# Altium schematic sheet Sensors.SchDoc
size A; SheetNumber: 3; SheetTotal: 8
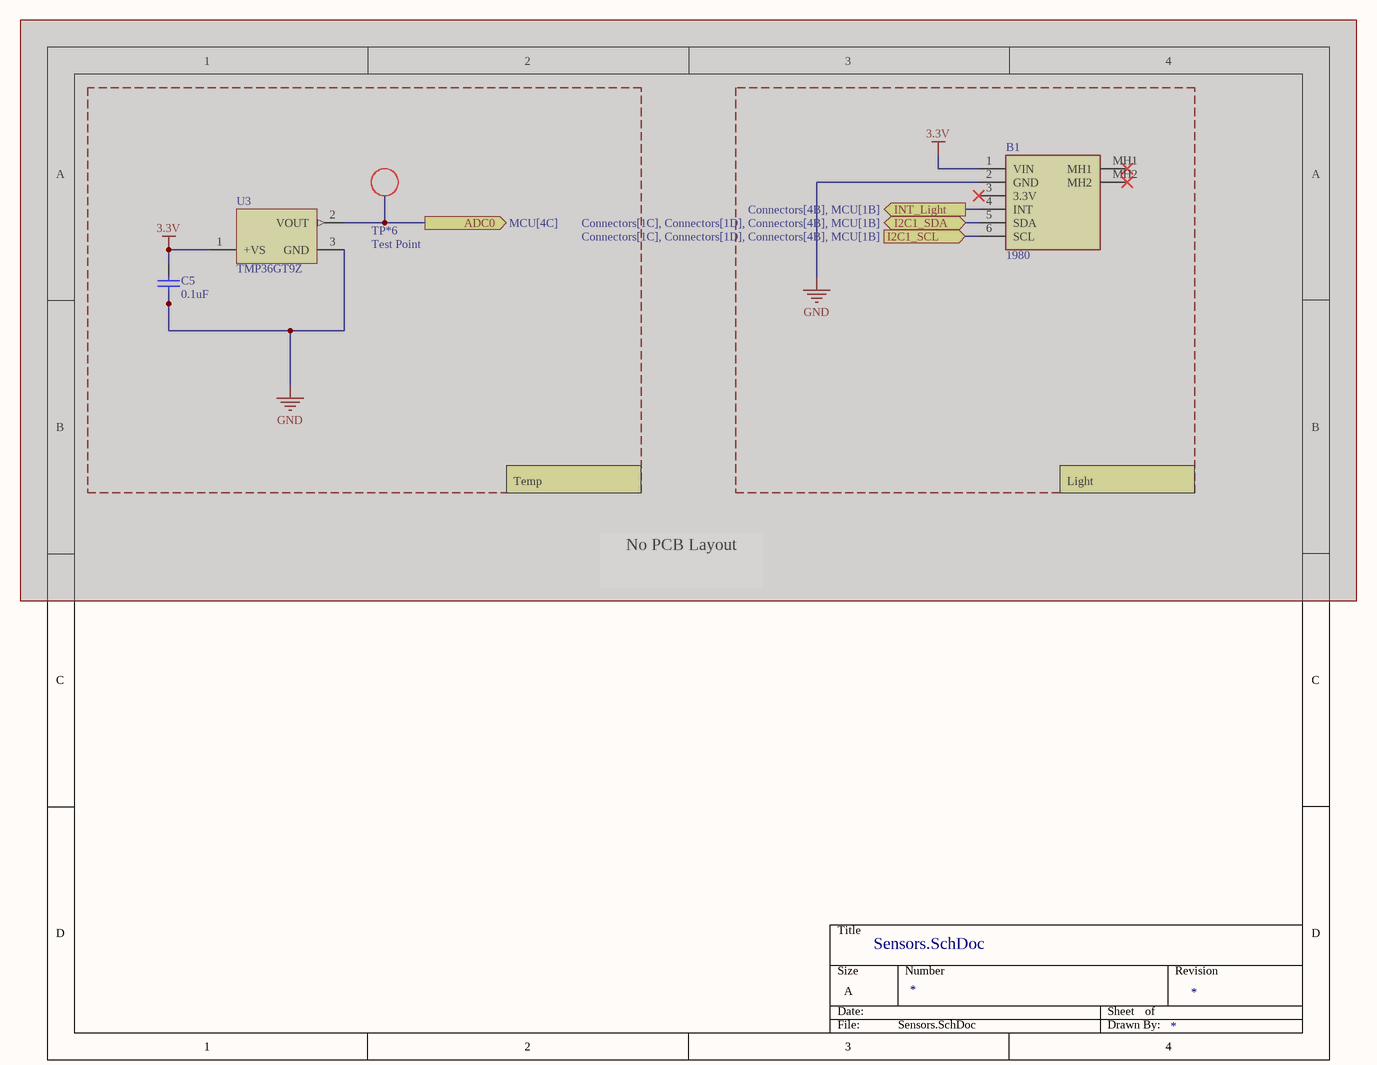
[diagram p0: Sensors.SchDoc]

## Parts
B1  1980  [1980]  (mechanical)  (masked out: inside a compile mask, not in the netlist)
C5  value 0.1uF  (hidden comment: Capacitor)  (masked out: inside a compile mask, not in the netlist)
TP*6  Test Point  [Test Point-Footprint-1]  (mechanical)  (masked out: inside a compile mask, not in the netlist)
U3  TMP36GT9Z  [ADI-T-3]  (mechanical)  (masked out: inside a compile mask, not in the netlist)

## Ports
ADC0 (out, see MCU[4C]), I2C1_SCL (in, see Connectors[1C], Connectors[1D], Connectors[4B], MCU[1B]), I2C1_SDA (bidir, see Connectors[1C], Connectors[1D], Connectors[4B], MCU[1B]), INT_Light (out, see Connectors[4B], MCU[1B])

## Notes on the sheet
- Temp
- Light
- No PCB Layout

## Library data of the parts
B1 = 1980: Optical Sensor Development Tools TSL2591 High Dynamic Digital Light Sensor; Manufacturer_Name: Adafruit; Geometry.Height: 3mm; Manufacturer_Part_Number: 1980; Mouser Part Number: 485-1980; Mouser Price/Stock: https://www.mouser.co.uk/ProductDetail/Adafruit/1980?qs=GURawfaeGuBXNh1gLjQA3Q%3D%3D; Arrow Part Number: 1980; Arrow Price/Stock: https://www.arrow.com/en/products/1980/adafruit-industries?region=nac; Datasheet Link: https://learn.adafruit.com/adafruit-tsl2591/downloads
C5 = Capacitor: SimulationGenericComponent: True
TP*6 = TP
U3 = CMP-0887-00067-1: Low Voltage Temperature Sensor, 2.7 to 5.5 V Supply, Industrial, 3-pin TO92 (T-3), Tray; Manufacturer: Analog Devices; ComponentLink2Description: Datasheet; PackageReference: T-3; Packing: Tray; ComponentLink2URL: http://www.analog.com/static/imported-files/data_sheets/TMP35_36_37.pdf; ComponentLink4Description: Product URL; ComponentLink3Description: Package Specification; Code_JEDEC: TO-226-AA; PartNumber: TMP36GT9Z; PackageDescription: 3-Pin Plastic Header-Style Package, 1.27 mm Pitch; PackageVersion: 042208-A, 04/2008; ComponentLink3URL: http://www.analog.com/static/imported-files/packages/PKG_PDF/TO-92(T)/T_3.pdf; ComponentLink1Description: Manufacturer URL; Supply Voltage Range: 2.7 to 5.5 V; Mounting Technology: Through Hole; DatasheetVersion: Rev. F; ComponentLink4URL: http://www.analog.com/en/mems-sensors/digital-temperature-sensors/tmp36/products/product.html; ComponentLink1URL: http://www.analog.com/en/index.html